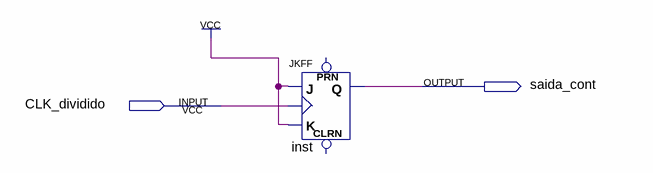
[diagram p0: schematic sheet]
// Quartus schematic contador_2bits.bdf as structural Verilog: 1 symbols, 2 pins
module contador_2bits (
  input  CLK_dividido,
  output saida_cont
);

  JKFF inst (.K(1'b1), .J(1'b1), .CLK(CLK_dividido), .Q(saida_cont));  // open: PRN, CLRN
endmodule
